# Altium schematic sheet Diagrama en bloques.SchDoc
size A4; DocumentNumber: 1; SheetNumber: 1; SheetTotal: 5
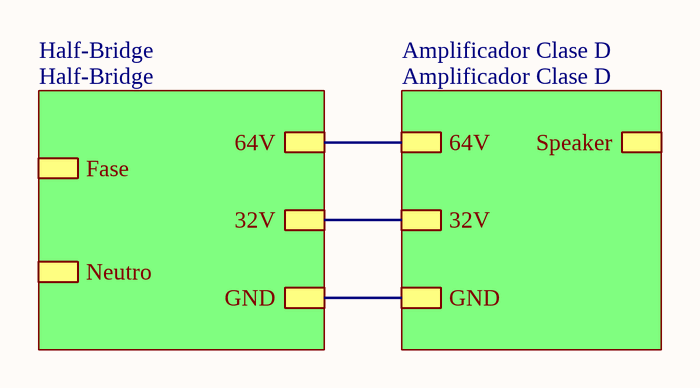
[diagram p0: Diagrama en bloques.SchDoc]

## Sub-sheets
Amplificador Clase D = Amplificador Clase D: Speaker, 64V, 32V, GND
Half-Bridge = Half-Bridge: Fase, Neutro, 64V, 32V, GND

## Nets
(unnamed): sheet Half-Bridge/64V, sheet Amplificador Clase D/64V
(unnamed): sheet Half-Bridge/32V, sheet Amplificador Clase D/32V
(unnamed): sheet Half-Bridge/GND, sheet Amplificador Clase D/GND